# EAGLE design py32f002b (EAGLE 9.6.1)
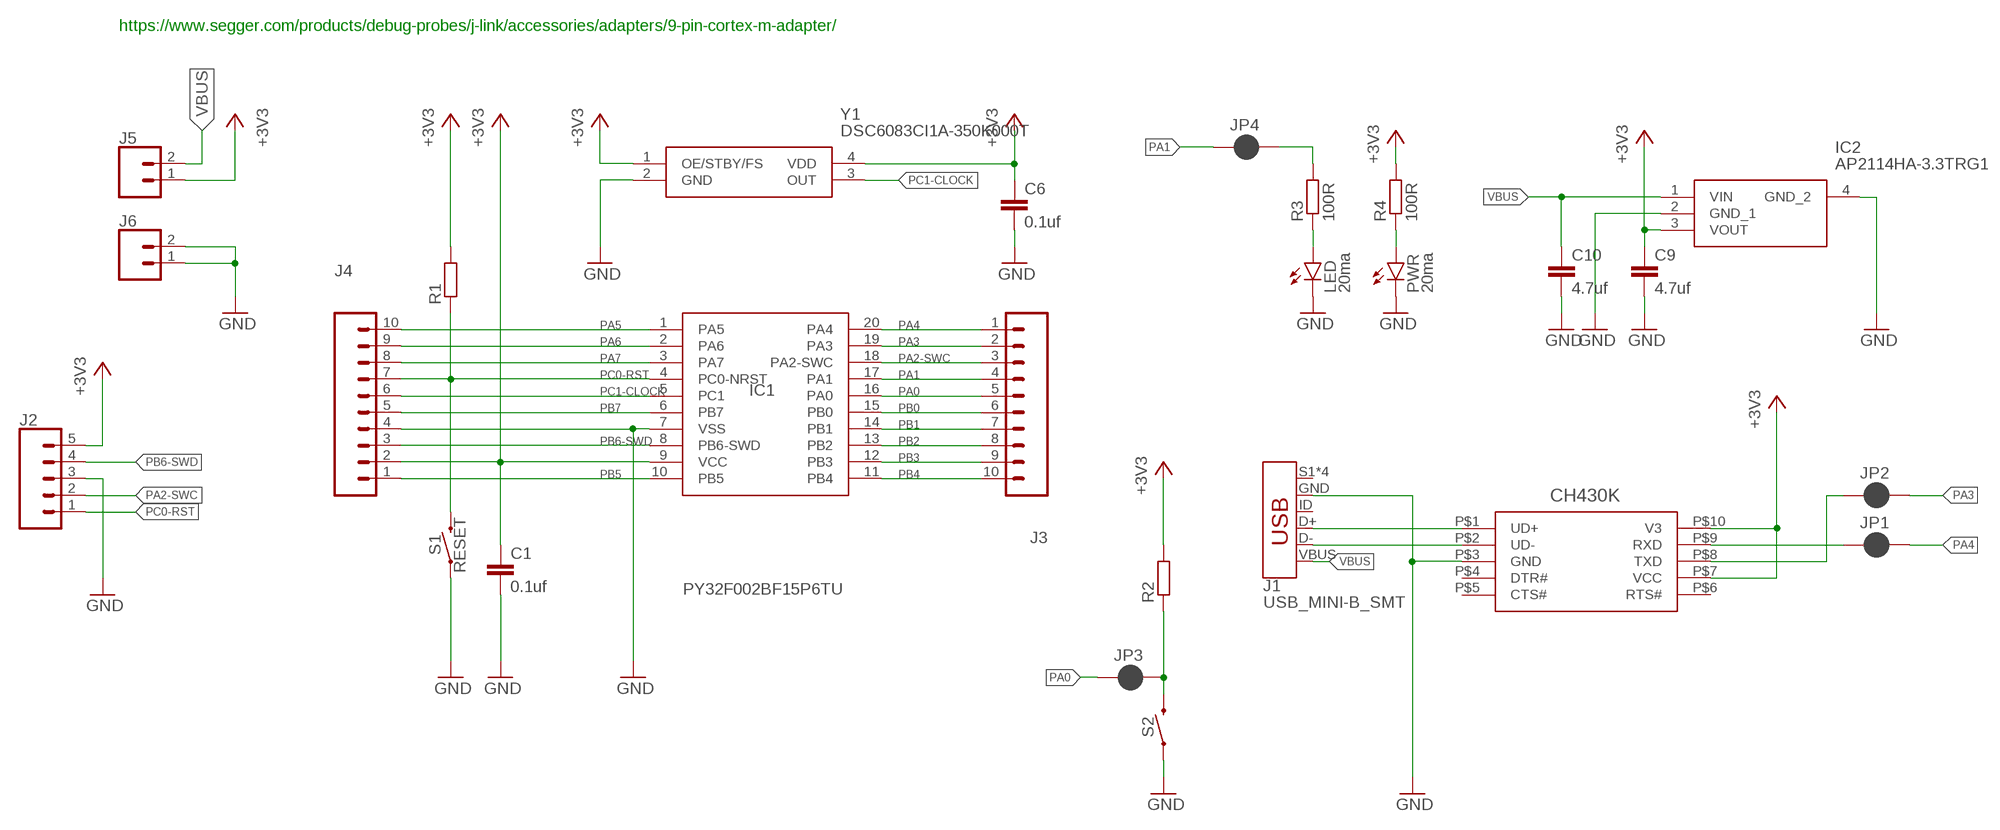
[diagram p0: schematic, sheet 1]

## Parts
C1  0.1uf  C-EUC0805  [C0805]
C6  0.1uf  C-EUC0805  [C0805]
C9  4.7uf  C-EUC0805  [C0805]
C10  4.7uf  C-EUC0805  [C0805]
IC1  PY32F002BF15P6TU  [TSSOP20]
IC2  AP2114HA-3.3TRG1  [SOT230P700X180-4N]
J1  USB_MINI-B_SMT  [USB-MINIB]
J2  CONN_05  [1X05]
J3  CONN_10"  [1X10]
J4  CONN_10"  [1X10]
J5  CONN_02  [1X02]
J6  CONN_02  [1X02]
JP1  JUMPER-SMT_2_NC_PASTE_SILK  [SMT-JUMPER_2_NC_PASTE_SILK]
JP2  JUMPER-SMT_2_NC_PASTE_SILK  [SMT-JUMPER_2_NC_PASTE_SILK]
JP3  JUMPER-SMT_2_NC_PASTE_SILK  [SMT-JUMPER_2_NC_PASTE_SILK]
JP4  JUMPER-SMT_2_NC_PASTE_SILK  [SMT-JUMPER_2_NC_PASTE_SILK]
LED  20ma  LEDSML0805  [SML0805]
PWR  20ma  LEDSML0805  [SML0805]
R1  R-EU_R0805  [R0805]
R2  R-EU_R0805  [R0805]
R3  100R  R-EU_R0805  [R0805]
R4  100R  R-EU_R0805  [R0805]
S1  RESET  MOMENTARY-SWITCH-SPST-SMD-6.0X3.5MM  [TACTILE_SWITCH_SMD_6.0X3.5MM]
S2  RESET  MOMENTARY-SWITCH-SPST-SMD-6.0X3.5MM  [TACTILE_SWITCH_SMD_6.0X3.5MM]
U$1  CH430K  [ESSOP-10]
Y1  DSC6083CI1A-350K000T  [DSC6083CI1A350K000T]

## Nets
+3V3: C1.1 C6.1 C9.1 IC1.9(VCC) IC2.3(VOUT) J2.5 J4.2 J5.1 R1.2 R2.2 R4.2 U$1.P$7(VCC) U$1.P$10(V3) Y1.1(OE/STBY/FS) Y1.4(VDD)
GND: C1.2 C6.2 C9.2 C10.2 IC1.7(VSS) IC2.2(GND_1) IC2.4(GND_2) J1.GND J2.3 J4.4 J6.1 J6.2 LED.C PWR.C S1.1 S2.1 U$1.P$3(GND) Y1.2(GND)
N$1: JP3.2 R2.1 S2.2
N$2 [logic]: LED.A R3.1
N$3: JP4.2 R3.2
N$6 [logic]: PWR.A R4.1
PA0: IC1.16(PA0) J3.5 JP3.1
PA1: IC1.17(PA1) J3.4 JP4.1
PA2-SWC: IC1.18(PA2-SWC) J2.2 J3.3
PA3: IC1.19(PA3) J3.2 JP2.2
PA4: IC1.20(PA4) J3.1 JP1.2
PA5: IC1.1(PA5) J4.10
PA6: IC1.2(PA6) J4.9
PA7: IC1.3(PA7) J4.8
PB0: IC1.15(PB0) J3.6
PB1: IC1.14(PB1) J3.7
PB2: IC1.13(PB2) J3.8
PB3: IC1.12(PB3) J3.9
PB4: IC1.11(PB4) J3.10
PB5: IC1.10(PB5) J4.1
PB6-SWD: IC1.8(PB6-SWD) J2.4 J4.3
PB7: IC1.6(PB7) J4.5
PC0-RST: IC1.4(PC0-NRST) J2.1 J4.7 R1.1 S1.2
PC1-CLOCK: IC1.5(PC1) J4.6 Y1.3(OUT)
U1RX: JP2.1 U$1.P$8(TXD)
U1TX: JP1.1 U$1.P$9(RXD)
USB_N: J1.D- U$1.P$2(UD-)
USB_P: J1.D+ U$1.P$1(UD+)
VBUS: C10.1 IC2.1(VIN) J1.VBUS J5.2
Unconnected: J1.ID J1.S1(SHIELD) J1.S2(SHIELD) J1.S3(SHIELD) J1.S4(SHIELD) U$1.P$4(DTR#) U$1.P$5(CTS#) U$1.P$6(RTS#)

## Notes on the sheet
- https://www.segger.com/products/debug-probes/j-link/accessories/adapters/9-pin-cortex-m-adapter/

## Library data of the parts
C1 C6 C9 C10 = rcl:C-EU: CAPACITOR, European symbol; SPICEPREFIX: C
IC1 = angelo-PY32F002BF15P6TU:PY32F002BF15P6TU
IC2 = AP2114HA-3.3TRG1:AP2114HA-3.3TRG1: Linear Voltage Regulator IC Positive Fixed 1 Output 1A SOT-223-3 Source: Datasheet <https://www.diodes.com//assets/Datasheets/AP2114.pdf>; ARROW_PART_NUMBER: AP2114HA-3.3TRG1; ARROW_PRICE-STOCK: https://www.arrow.com/en/products/ap2114ha-3.3trg1/diodes-incorporated?region=asia; DESCRIPTION: Linear Voltage Regulator IC Positive Fixed 1 Output 1A SOT-223-3; HEIGHT: 1.8mm; MANUFACTURER_NAME: Diodes Incorporated; MANUFACTURER_PART_NUMBER: AP2114HA-3.3TRG1; MOUSER_PART_NUMBER: 621-AP2114HA-3.3TRG1; MOUSER_PRICE-STOCK: https://www.mouser.co.uk/ProductDetail/Diodes-Incorporated/AP2114HA-3.3TRG1?qs=M%2FOdCRO8QQ3KWhA9Gt6VoQ%3D%3D
J1 = SparkFun-Connectors:USB_MINI-B: USB type Mini-B Connector Breaks out 5th pin, and includes shield pins if needed. SparkFun Products: SparkFun FTDI Basic Breakout <https://www.sparkfun.com/products/9716> SparkFun XBee Explorer USB <https://www.sparkfun.com/products/11812> SparkFun Redboard <https://www.sparkfun.com/products/12757>; PROD_ID: CONN-08193; SF_ID: PRT-00587
J2 = SparkFun-Connectors:CONN_05: Multi connection point. Often used as Generic Header-pin footprint for 0.1 inch spaced/style header connections On any of the 0.1 inch spaced packages, you can populate with these: Break Away Headers - Straight <https://www.sparkfun.com/products/116> (PRT-00116) Break Away Male Headers - Right Angle <https://www.sparkfun.com/products/553> (PRT-00553) Female Headers <https://www.sparkfun.com/products/115> (PRT-00115) Break Away Headers - Machine Pin <https://www.sparkfun.com/products/117> (PRT-00117) Break Away Female Headers - Swiss Machine Pin <https://www.sparkfun.com/products/743> (PRT-00743) For SCREWTERMINALS and SPRING TERMINALS visit here: Screw Terimnals on SparkFun.com <https://www.sparkfun.com/search/results?term=Screw+Terminals> (5mm/3.5mm/2.54mm spacing) This device is also useful as a general connection point to wire up your design to another part of your project. Our various solder wires solder well into these plated through hole pads. Hook-Up Wire - Assortment (Stranded, 22 AWG) <https://www.sparkfun.com/products/11375> (PRT-11375) Hook-Up Wire - Assortment (Solid Core, 22 AWG) <https://www.sparkfun.com/products/11367> (PRT-11367) View the entire wire category on our website here <https://www.sparkfun.com/categories/141> Special notes: Molex polarized connector foot print use with SKU : PRT-08231 with associated crimp pins and housings. 1MM SMD Version SKU: PRT-10208
J3 J4 = SparkFun-Connectors:CONN_10: Multi connection point. Often used as Generic Header-pin footprint for 0.1 inch spaced/style header connections On any of the 0.1 inch spaced packages, you can populate with these: Break Away Headers - Straight <https://www.sparkfun.com/products/116> (PRT-00116) Break Away Male Headers - Right Angle <https://www.sparkfun.com/products/553> (PRT-00553) Female Headers <https://www.sparkfun.com/products/115> (PRT-00115) Break Away Headers - Machine Pin <https://www.sparkfun.com/products/117> (PRT-00117) Break Away Female Headers - Swiss Machine Pin <https://www.sparkfun.com/products/743> (PRT-00743) Arduino Stackable Header - 10 Pin <https://www.sparkfun.com/products/11376> (PRT-11376) For SCREWTERMINALS and SPRING TERMINALS visit here: Screw Terimnals on SparkFun.com <https://www.sparkfun.com/search/results?term=Screw+Terminals> (5mm/3.5mm/2.54mm spacing) This device is also useful as a general connection point to wire up your design to another part of your project. Our various solder wires solder well into these plated through hole pads. Hook-Up Wire - Assortment (Stranded, 22 AWG) <https://www.sparkfun.com/products/11375> (PRT-11375) Hook-Up Wire - Assortment (Solid Core, 22 AWG) <https://www.sparkfun.com/products/11367> (PRT-11367) View the entire wire category on our website here <https://www.sparkfun.com/categories/141> Special notes: Molex polarized connector foot print use with SKU : PRT-08231 with associated crimp pins and housings. 1MM SMD Version SKU: PRT-10208 NOTES ON THE VARIANTS LOCK and LOCK_LONGPADS... This footprint was designed to help hold the alignment of a through-hole component (i.e. 6-pin header) while soldering it into place. You may notice that each hole has been shifted either up or down by 0.005 of an inch from it's more standard position (which is a perfectly straight line). This slight alteration caused the pins (the squares in the middle) to touch the edges of the holes. Because they are alternating, it causes a "brace" to hold the component in place. 0.005 has proven to be the perfect amount of "off-center" position when using our standard breakaway headers. Although looks a little odd when you look at the bare footprint, once you have a header in there, the alteration is very hard to notice. Also,if you push a header all the way into place, it is covered up entirely on the bottom side.; PROD_ID: CONN-11563
J5 J6 = SparkFun-Connectors:CONN_02: Multi connection point. Often used as Generic Header-pin footprint for 0.1 inch spaced/style header connections On any of the 0.1 inch spaced packages, you can populate with these: Break Away Headers - Straight <https://www.sparkfun.com/products/116> (PRT-00116) Break Away Male Headers - Right Angle <https://www.sparkfun.com/products/553> (PRT-00553) Female Headers <https://www.sparkfun.com/products/115> (PRT-00115) Break Away Headers - Machine Pin <https://www.sparkfun.com/products/117> (PRT-00117) Break Away Female Headers - Swiss Machine Pin <https://www.sparkfun.com/products/743> (PRT-00743) For SCREWTERMINALS and SPRING TERMINALS visit here: Screw Terimnals on SparkFun.com <https://www.sparkfun.com/search/results?term=Screw+Terminals> (5mm/3.5mm/2.54mm spacing) This device is also useful as a general connection point to wire up your design to another part of your project. Our various solder wires solder well into these plated through hole pads. Hook-Up Wire - Assortment (Stranded, 22 AWG) <https://www.sparkfun.com/products/11375> (PRT-11375) Hook-Up Wire - Assortment (Solid Core, 22 AWG) <https://www.sparkfun.com/products/11367> (PRT-11367) View the entire wire category on our website here <https://www.sparkfun.com/categories/141> Special notes: Molex polarized connector foot print use with: PRT-08233 with associated crimp pins and housings. 2.54_SCREWTERM for use with PRT-10571. 3.5mm Screw Terminal footprints for PRT-08084 5mm Screw Terminal footprints for use with PRT-08432
JP1-JP4 = SparkFun-Jumpers:JUMPER-SMT_2_NC_PASTE: Normally closed solder jumper This jumper has an aperture in the stencil to allow solder paste to bridge the split in the wire so it's normally closed (NC). Wick off the solder to open the connection. Reapply solder to reclose the connection.
LED PWR = led:LED: LED OSRAM: - CHIPLED LG R971, LG N971, LY N971, LG Q971, LY Q971, LO R971, LY R971 LH N974, LH R974 LS Q976, LO Q976, LY Q976 LO Q996 - Hyper CHIPLED LW Q18S LB Q993, LB Q99A, LB R99A - SideLED LS A670, LO A670, LY A670, LG A670, LP A670 LB A673, LV A673, LT A673, LW A673 LH A674 LY A675 LS A676, LA A676, LO A676, LY A676, LW A676 LS A679, LY A679, LG A679 - Hyper Micro SIDELED® LS Y876, LA Y876, LO Y876, LY Y876 LT Y87S - SmartLED LW L88C, LW L88S LB L89C, LB L89S, LG L890 LS L89K, LO L89K, LY L89K LS L896, LA L896, LO L896, LY L896 - TOPLED LS T670, LO T670, LY T670, LG T670, LP T670 LSG T670, LSP T670, LSY T670, LOP T670, LYG T670 LG T671, LOG T671, LSG T671 LB T673, LV T673, LT T673, LW T673 LH T674 LS T676, LA T676, LO T676, LY T676, LB T676, LH T676, LSB T676, LW T676 LB T67C, LV T67C, LT T67C, LS T67K, LO T67K, LY T67K, LW E67C LS E67B, LA E67B, LO E67B, LY E67B, LB E67C, LV E67C, LT E67C LW T67C LS T679, LY T679, LG T679 LS T770, LO T770, LY T770, LG T770, LP T770 LB T773, LV T773, LT T773, LW T773 LH T774 LS E675, LA E675, LY E675, LS T675 LS T776, LA T776, LO T776, LY T776, LB T776 LHGB T686 LT T68C, LB T68C - Hyper Mini TOPLED® LB M676 - Mini TOPLED Santana® LG M470 LS M47K, LO M47K, LY M47K Source: http://www.osram.convergy.de LUXEON: - LUMILED® LXK2-PW12-R00, LXK2-PW12-S00, LXK2-PW14-U00, LXK2-PW14-V00 LXK2-PM12-R00, LXK2-PM12-S00, LXK2-PM14-U00 LXK2-PE12-Q00, LXK2-PE12-R00, LXK2-PE12-S00, LXK2-PE14-T00, LXK2-PE14-U00 LXK2-PB12-K00, LXK2-PB12-L00, LXK2-PB12-M00, LXK2-PB14-N00, LXK2-PB14-P00, LXK2-PB14-Q00 LXK2-PR12-L00, LXK2-PR12-M00, LXK2-PR14-Q00, LXK2-PR14-R00 LXK2-PD12-Q00, LXK2-PD12-R00, LXK2-PD12-S00 LXK2-PH12-R00, LXK2-PH12-S00 LXK2-PL12-P00, LXK2-PL12-Q00, LXK2-PL12-R00 Source: www.luxeon.com KINGBRIGHT: KA-3528ASYC Source: www.kingbright.com
R1-R4 = rcl:R-EU_: RESISTOR, European symbol; SPICEPREFIX: R
S1 S2 = SparkFun-Switches:MOMENTARY-SWITCH-SPST: Momentary Switch (Pushbutton) - SPST Normally-open (NO) SPST momentary switches (buttons, pushbuttons). Variants PTH-12MM - 12mm square, through-hole Momentary Pushbutton Switch - 12mm Square <https://www.sparkfun.com/products/9190> (COM-09190) PTH-6.0MM, PTH-6.0MM-KIT - 6.0mm square, through-hole Mini Pushbutton Switch <https://www.sparkfun.com/products/97> (COM-00097) KIT package intended for soldering kit's - only one side of pads' copper is exposed. PTH-RIGHT-ANGLE-KIT - Right-angle, through-hole Right Angle Tactile Button <https://www.sparkfun.com/products/10791> - Used on SparkFun BigTime Watch Kit <https://www.sparkfun.com/products/11734> SMD-12MM - 12mm square, surface-mount Tactile Button - SMD (12mm) <https://www.sparkfun.com/products/12993> (COM-12993) Used on SparkFun PicoBoard <https://www.sparkfun.com/products/11888> SMD-4.5MM - 4.5mm Square Trackball Switch Used on SparkFun Blackberry Trackballer Breakout <https://www.sparkfun.com/products/13169> SMD-4.6MMX2.8MM - 4.60mm x 2.80mm, surface mount Used on SparkFun SAMD21 Mini Breakout <https://www.sparkfun.com/products/13664> SMD-5.2MM, SMD-5.2-REDUNDANT - 5.2mm square, surface-mount Mini Pushbutton Switch - SMD <https://www.sparkfun.com/products/8720> (COM-08720) Used on Arduino Pro Mini <https://www.sparkfun.com/products/11114> REDUNDANT package connects both switch circuits together SMD-6.0X3.5MM - 6.0 x 3.5mm, surface mount Momentary Reset Switch SMD <https://www.sparkfun.com/products/8229> (COM-08229) SMD-6.2MM-TALL - 6.2mm square, surface mount Tactile Button - SMD (6mm) <https://www.sparkfun.com/products/12992> Used on SparkFun Digital Sandbox <https://www.sparkfun.com/products/12651> SMD-RIGHT-ANGLE - Right-angle, surface mount Used on SparkFun Block for Intel® Edison - Arduino <https://www.sparkfun.com/products/13036>; PROD_ID: SWCH-14278; SF_SKU: COM-08229
U$1 = ch340k-nopad:CH430K: CH340K usb - uart
Y1 = angelo-DSC6083CI1A-350K000T:DSC6083CI1A-350K000T: Standard Clock Oscillators MEMS Oscillator, Ultra Low Power, LVCMOS, -40C-85C, 50ppm, 3.2x2.5mm Source: Datasheet <http://ww1.microchip.com/downloads/en/DeviceDoc/DSC60XX-Ultra-Small-Ultra-Low-Power-MEMS-Oscillator-DS20005625C.pdf>; ARROW_PART_NUMBER: DSC6083CI1A-350K000T; ARROW_PRICE-STOCK: https://www.arrow.com/en/products/dsc6083ci1a-350k000t/microchip-technology; DESCRIPTION: Standard Clock Oscillators MEMS Oscillator, Ultra Low Power, LVCMOS, -40C-85C, 50ppm, 3.2x2.5mm; HEIGHT: 0.9mm; MANUFACTURER_NAME: Microchip; MANUFACTURER_PART_NUMBER: DSC6083CI1A-350K000T; MOUSER_PART_NUMBER: 579-DSC6083CI1A350K; MOUSER_PRICE-STOCK: https://www.mouser.com/Search/Refine.aspx?Keyword=579-DSC6083CI1A350K

## Net classes
0 default: width 0.152 mm, drill 0.152 mm, clearance 0.152 mm
1 logic: width 0.152 mm, drill 0.254 mm, clearance 0.152 mm
2 power: width 0.406 mm, drill 0.254 mm, clearance 0.203 mm

## Board
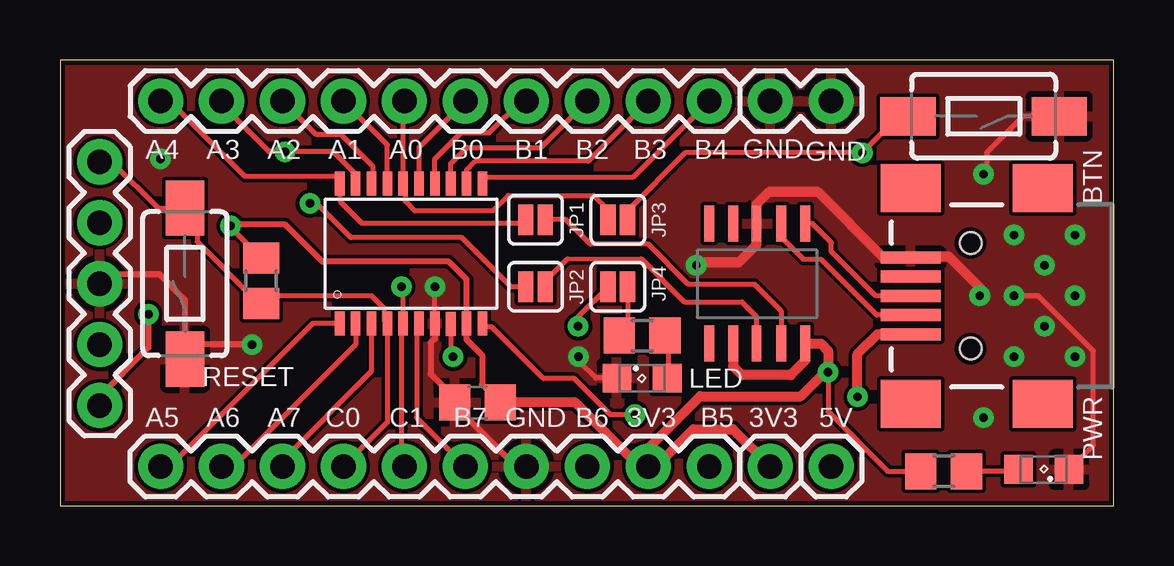
[diagram p1: board, top side]
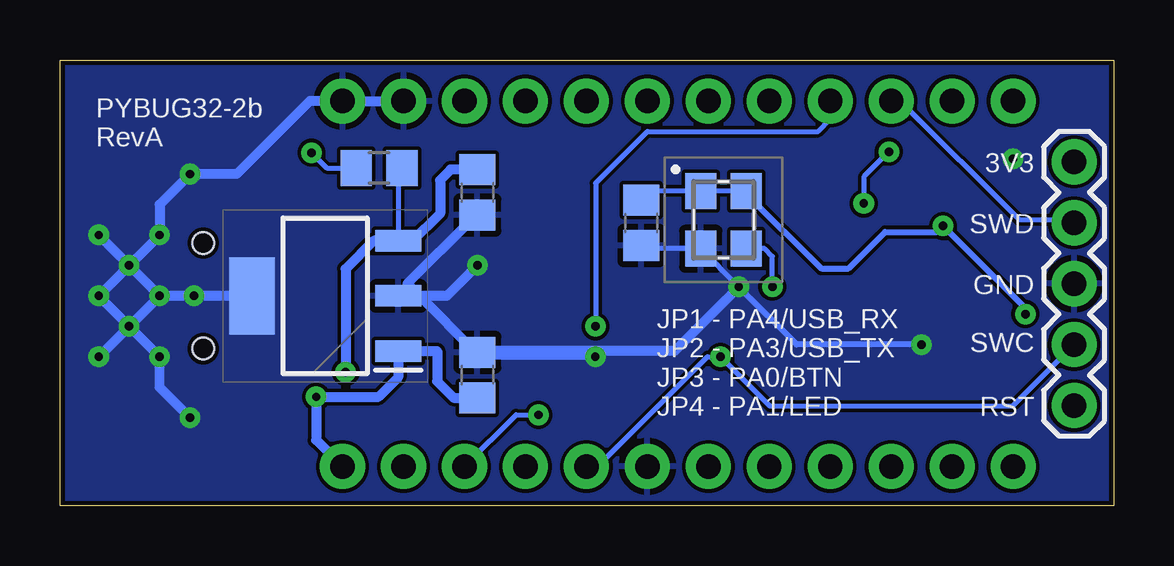
[diagram p2: board, bottom side, seen from below]

Size 43.9 x 18.6 mm. Coordinates in mm from the lower left corner, seen from the top.
Outline: 0,0 43.9,0 43.9,18.6 0,18.6 0,0
Copper layers (1*16): Top 0.035mm / dielectric 1.6mm / Bottom 0.035mm
Design rules "angelo-jlcpcb-2layers": minimum track width 8mil, minimum drill 0.3mm, track to track 6mil, track to pad 6mil, pad to pad 6mil, via to via 10mil, smd to smd 6mil, copper to edge 0.2mm, drill to drill 8mil, minimum pad ring 10mil, minimum via ring 10mil, stop-mask expansion 4mil, vias tented up to drill 0mil, thermal gap 10mil

### Footprints (pad centres in the part's own frame; a part is rotated, then mirrored left to right if it is on the bottom)
C0805 = smd 1.3 x 1.5: 1 -0.95,0; 2 0.95,0
TSSOP20 = smd 1 x 0.4: 1 -2.937,2.693; 2 -2.937,2.032; 3 -2.937,1.372; 4 -2.937,0.712; 5 -2.937,0.051; 6 -2.937,-0.609; 7 -2.937,-1.27; 8 -2.943,-1.93; 9 -2.937,-2.59; 10 -2.937,-3.251; 11 2.905,-3.251; 12 2.905,-2.59; 13 2.911,-1.93; 14 2.905,-1.27; 15 2.905,-0.609; 16 2.905,0.051; 17 2.905,0.712; 18 2.905,1.372; 19 2.905,2.032; 20 2.905,2.693
SOT230P700X180-4N = smd 1.9 x 0.9: 1 -3.05,2.3; 2 -3.05,0; 3 -3.05,-2.3 | smd 1.9 x 3.2: 4 3.05,0
USB-MINIB = smd 2.5 x 0.5: D+ 2.5,0; D- 2.5,0.8; GND 2.5,-1.6; ID 2.5,-0.8; VBUS 2.5,1.6 | smd 2.5 x 2: S1 -3,4.5; S2 2.5,4.5; S3 -3,-4.5; S4 2.5,-4.5 | hole 0.9: 0,2.2; 0,-2.2
1X05 = drill 1.016 pad 1.88: 1 0,0; 2 2.54,0; 3 5.08,0; 4 7.62,0; 5 10.16,0
1X10 = drill 1.016 pad 1.88: 1 0,0; 2 2.54,0; 3 5.08,0; 4 7.62,0; 5 10.16,0; 6 12.7,0; 7 15.24,0; 8 17.78,0; 9 20.32,0; 10 22.86,0
1X02 = drill 1.016 pad 1.88: 1 0,0; 2 2.54,0
SMT-JUMPER_2_NC_PASTE_SILK = smd 0.635 x 1.27: 1 -0.406,0; 2 0.406,0
SML0805 = smd 1.2 x 1.2: A 1.05,0; C -1.05,0
R0805 = smd 1.3 x 1.5: 1 -0.95,0; 2 0.95,0
TACTILE_SWITCH_SMD_6.0X3.5MM = smd 2.3 x 1.6: 1 -3.15,0; 2 3.15,0
ESSOP-10 = smd 1.5 x 0.4: P$1 -2.5,2; P$2 -2.5,1; P$3 -2.5,-0.032; P$4 -2.5,-1; P$5 -2.5,-2; P$6 2.5,-2; P$7 2.5,-1; P$8 2.5,-0.032; P$9 2.5,1; P$10 2.5,2
DSC6083CI1A350K000T = smd 1.5 x 1.3: 1 1.2,0.95; 2 -1.2,0.95; 3 -1.2,-0.95; 4 1.2,-0.95

### Placement (x,y rotation side)
C1  17.4,4.32 180 top
C6  19.68,11.81 270 bottom
C9  26.51,13.08 270 bottom
C10  26.51,5.46 90 bottom
IC1  14.35,10.54 90 top
IC2  32.86,8.76 180 bottom
J1  37.94,8.76 180 top
J2  1.65,14.35 270 top
J3  4.19,16.89 0 top
J4  27.05,1.65 180 top
J5  29.59,1.65 0 top
J6  29.59,16.89 0 top
JP1  19.81,11.94 180 top
JP2  19.81,9.14 180 top
JP3  23.24,11.94 0 top
JP4  23.24,9.14 0 top
LED  24.26,5.33 0 top
PWR  40.99,1.52 180 top
R1  8.38,9.4 90 top
R2  30.61,14.1 0 bottom
R3  24.26,7.11 180 top
R4  36.82,1.46 180 top
S1  5.21,9.27 90 top
S2  38.48,16.26 180 top
U$1  29.05,9.27 270 top
Y1  16.26,11.94 90 bottom

### Tracks (layer width: path | path; a pad name or v marks a point on that pad's centre or on a via)
+3V3  (via drill 0.35)
  Top 0.203: v7.11,11.68 7.11,11.62 R1.2 | v32,5.59 32,3.94 34.48,1.46 R4.2
  Top 0.254: C1.1 17.59,5.08 17.59,6.29 16.94,6.93 IC1.9 16.94,9.45 16.2,10.19 10.93,10.19 9.38,11.74 7.23,11.74 7.11,11.62 | v3.68,8 3.68,6.6 1.65,4.57 J2.5
  Top 0.406: C1.1 21.46,4.32 24.13,1.65 J4.2 | J4.2 24.51,2.41 26.67,4.57 30.86,4.57 31.88,5.59 v32,5.59 32,6.48 31.71,6.77 U$1.P$10 31.05,6.06 30.45,5.46 28.42,5.46 28.05,5.83 U$1.P$7 | J4.2 24.84,1.65 26.39,3.2 28.04,3.2 J5.1
  Bottom 0.203: 15.37,13.08 Y1.4 Y1.1 19.31,13.14 C6.1 | R2.2 29.81,13.94 IC2.3
  Bottom 0.254: 15.37,13.08 12.19,9.91 11.05,9.91 9.53,11.43 7.37,11.43 v7.11,11.68 3.68,8.26 v3.68,8
  Bottom 0.406: v32,5.59 32,9.89 30.83,11.06 IC2.3 29.2,11.06 28.07,12.19 28.07,13.59 27.62,14.03 C9.1
GND  (via drill 0.35)
  Top 0.203: IC1.7 v15.62,9.14 | v15.62,9.14 | S1.1 5.21,6.73 | v39.75,8.76 40.77,8.76 43.05,6.48 43.05,2.54 PWR.C | LED.C 22.32,5.33 21.6,6.05 v21.6,6.22 | S2.1 40.13,16.26 38.61,14.73 38.61,13.97 v38.48,13.84
  Top 0.254: IC1.7 15.62,6.99 15.45,6.81 15.45,5.51 16.45,4.51 C1.2 16.45,4.19 18.99,1.65 J4.4 | v8,6.73 5.21,6.73 5.21,8.6 4.13,9.68 2.06,9.68 J2.3
  Top 0.406: v38.32,8.76 38.32,9.12 37.04,10.4 35.48,10.4 J1.GND 34.31,10.36 31.56,13.11 29.55,13.11 29.02,12.57 U$1.P$3 29.02,10.89 28.29,10.16 26.51,10.16 v26.51,10.03
  Bottom 0.203: v21.6,6.22 26.32,6.22 C10.2 26.58,6.48 26.64,6.48 | v15.62,9.14 17.21,10.73 Y1.2 19.56,10.74 C6.2
  Bottom 0.254: v15.62,9.14 13.21,6.73 v8,6.73
  Bottom 0.406: 28.92,8.76 IC2.2 27.78,8.76 v26.51,10.03 | IC2.4 v38.32,8.76 v39.75,8.76 | C9.2 26.59,12.13 26.73,12.21 26.73,11.97 29.43,9.27 28.92,8.76 | 28.92,8.76 26.64,6.48 18.29,6.48 v15.62,9.14 | J6.1 J6.2 33.5,16.89 36.54,13.84 v38.48,13.84 39.75,12.57 v39.75,11.3 v41.02,10.03 | v38.48,3.68 39.75,4.95 v39.75,6.22 v41.02,7.49 | v41.02,10.03 v42.29,11.3 | v41.02,10.03 v42.29,8.76 v41.02,7.49 | v41.02,10.03 v39.75,8.76 | v39.75,8.76 v41.02,7.49 | v41.02,7.49 v42.29,6.22
  other vias: 4.19,14.48
  pour Bottom: 0,0 0,18.6 43.9,18.6 43.9,0
  pour Top: 0,0 0,18.6 43.9,18.6 43.9,0
  pour Bottom (no thermals): 33.4,12.06 37.21,12.06 37.21,5.46 33.4,5.46
N$1  (via drill 0.35)
  Top 0.203: JP3.2 23.65,12.32 26.06,14.73 v33.43,14.73 34.95,16.26 S2.2
  Bottom 0.203: v33.43,14.73 32.79,14.1 R2.1
N$2
  Top 0.203: R3.1 25.33,6.99 25.33,5.33 LED.A
N$3
  Top 0.203: JP4.2 23.65,7.45 R3.2
N$6
  Top 0.203: PWR.A 39.87,1.46 R4.1
PA0
  Top 0.203: J3.5 14.3,16.84 IC1.16 14.38,13.37 14.38,12.71 14.77,12.32 18.03,12.32 18.67,12.95 22.23,12.95 22.84,12.34 JP3.1
PA1  (via drill 0.35)
  Top 0.203: J3.4 13.64,15.06 IC1.17 | JP4.1 21.59,7.9 v21.59,7.49
  Bottom 0.203: v21.59,7.49 21.59,13.46 19.43,15.62 12.32,15.62 11.81,16.13 J3.4
PA2-SWC
  Top 0.203: IC1.18 13.03,13.45 13.03,14.18 11.71,15.49 10.67,15.49 J3.3
  Bottom 0.203: J3.3 8.89,16.89 3.94,11.94 1.78,11.94 J2.2
PA3  (via drill 0.35)
  Top 0.203: JP2.2 18.8,9.14 16.74,11.2 12.12,11.2 10.7,12.62 v10.41,12.62 | IC1.19 12.32,13.85 11.38,14.78 v9.37,14.78 8.72,14.78 6.73,16.76 J3.2
  Bottom 0.203: v9.37,14.78 10.41,13.73 v10.41,12.62
PA4
  Top 0.203: J3.1 4.57,16.89 7.72,13.75 11.66,13.75 IC1.20 11.66,12.73 12.6,11.78 19.41,11.78 JP1.2
PA5
  Top 0.203: J4.10 4.57,1.65 10.53,7.6 IC1.1
PA6
  Top 0.203: IC1.2 12.32,6.73 7.24,1.65 J4.9
PA7
  Top 0.203: J4.8 9.27,1.91 12.98,5.61 IC1.3
PB0
  Top 0.203: J3.6 14.96,14.96 IC1.15
PB1
  Top 0.203: J3.7 19.21,16.89 17.89,15.57 16.71,15.57 15.62,14.48 IC1.14
PB2
  Top 0.203: J3.8 20.03,14.95 16.95,14.95 16.28,14.28 IC1.13
PB3
  Top 0.203: J3.9 22,14.38 17.31,14.38 16.94,14.02 IC1.12
PB4
  Top 0.203: J3.10 23.86,13.7 17.73,13.7 17.6,13.57 IC1.11
PB5  (via drill 0.35)
  Top 0.203: IC1.10 17.73,7.48 17.98,7.48 20.14,5.32 21.42,5.32 22.94,3.8 v23.96,3.8
  Bottom 0.203: J4.1 24.9,3.8 v23.96,3.8
PB6-SWD  (via drill 0.35)
  Top 0.203: v16.38,6.22 16.28,6.33 IC1.8
  Bottom 0.203: J4.3 21.5,1.65 16.93,6.22 v16.38,6.22 14.33,4.17 4.21,4.17 J2.4
PB7
  Top 0.203: IC1.6 14.86,7.5 14.86,3.68 J4.5
PC0-RST
  Top 0.203: J4.7 13.64,3.48 IC1.4 13.51,7.73 13.51,8.24 12.99,8.76 8.7,8.76 R1.1 8.26,8.57 8.16,8.57 5.71,11.02 5.71,11.91 S1.2 4.09,12.42 2.16,14.35 J2.1
PC1-CLOCK  (via drill 0.35)
  Top 0.203: J4.6 14.22,1.78 14.22,7.53 IC1.5 14.3,9.07 v14.22,9.14
  Bottom 0.203: v14.22,9.14 14.22,10.41 14.55,10.74 Y1.3
U1RX
  Top 0.203: U$1.P$8 29.01,7.91 28.41,8.51 26.02,8.51 24.21,10.31 21.14,10.31 20.42,9.6 20.22,9.4 JP2.1
U1TX
  Top 0.203: U$1.P$9 30.05,8.14 28.95,9.25 26.19,9.25 24.51,10.92 22.1,10.92 21.08,11.94 JP1.1
USB_N
  Top 0.203: U$1.P$2 30.05,11.22 30.99,10.29 31.71,10.29 34.03,7.96 J1.D-
USB_P
  Top 0.203: U$1.P$1 31.35,11.77 32.14,10.98 32.14,10.61 33.99,8.76 J1.D+
VBUS  (via drill 0.35)
  Top 0.406: v33.23,4.55 33.23,6.34 34.05,7.16 J1.VBUS
  Bottom 0.406: C10.1 27.5,4.51 28.19,5.21 28.19,6.46 IC2.1 29.81,5.37 30.63,4.55 v33.23,4.55 33.23,2.75 J5.2

### Text on the board
tNames: GND | BTN | A4 | A3 | A2 | A1 | A0 | B0 | B1 | B2 | B3 | B4 | GND | RESET | A5 | A6 | A7 | C0 | C1 | B7 | GND | B6 | 3V3 | B5 | 3V3 | 5V
bNames: 3V3 | PYBUG32-2b / RevA | SWD | GND | SWC | RST | JP1 - PA4/USB_RX / JP2 - PA3/USB_TX / JP3 - PA0/BTN / JP4 - PA1/LED